# Altium schematic sheet Switches.SchDoc
size A; SheetNumber: 7
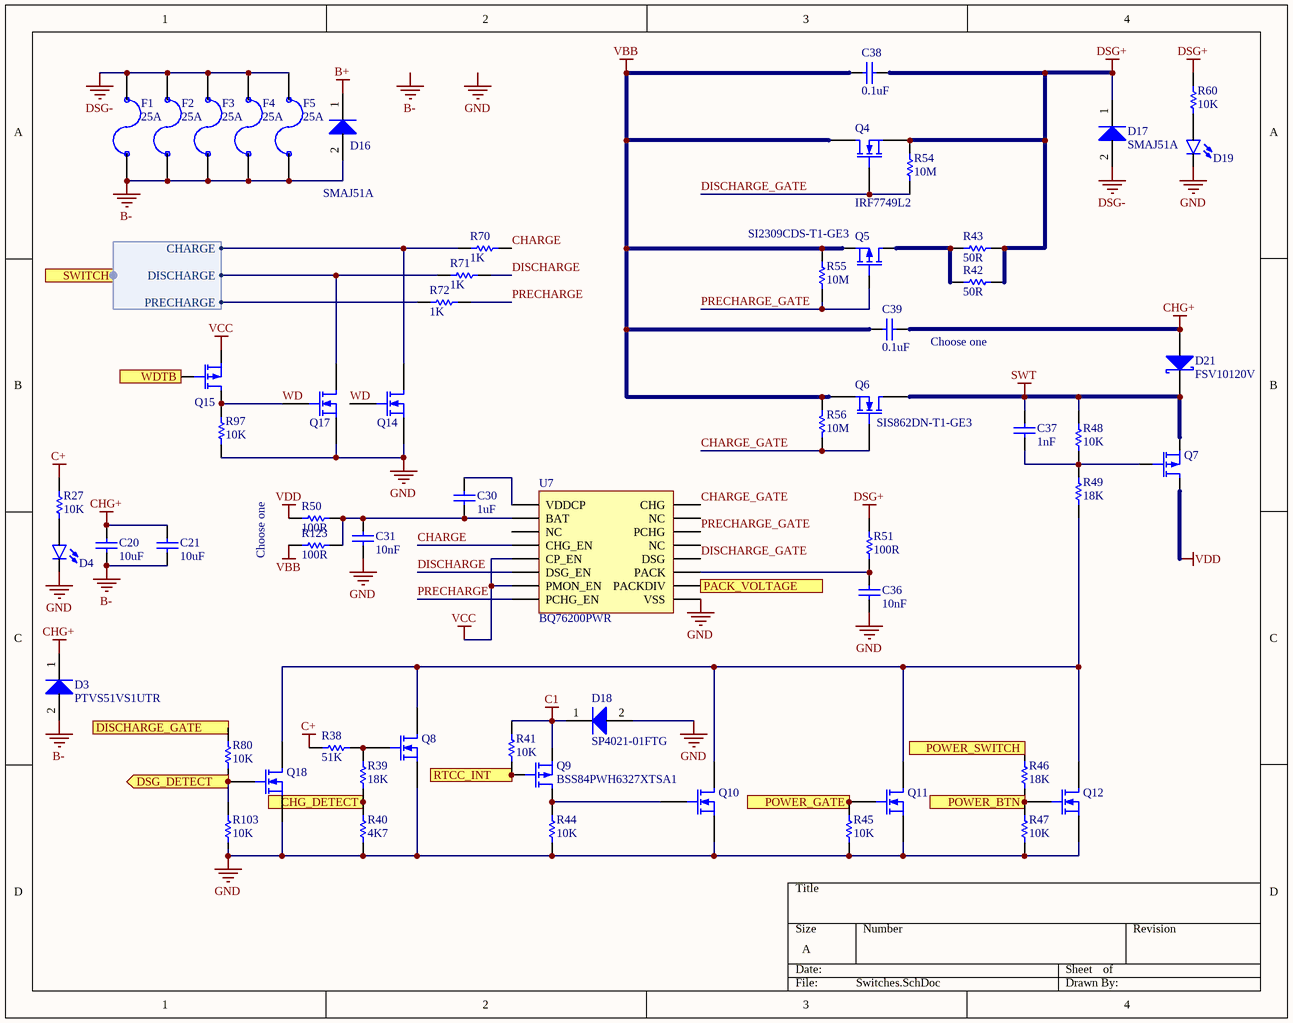
[diagram p0: Switches.SchDoc]

## Parts
C20  value 10uF  [C1206[3216X160]]  (hidden comment: 10uF 50V 1206)
C21  value 10uF  [C1206[3216X160]]  (hidden comment: 10uF 50V 1206)
C30  value 1uF  [C0603[1608X92]]  (hidden comment: 1uF 50V 0603)
C31  value 10nF  [C0603[1608X92]]  (hidden comment: 10nF 100V 0603)
C36  value 10nF  [C0603[1608X92]]  (hidden comment: 10nF 100V 0603)
C37  value 1nF  [C0603[1608X92]]  (hidden comment: 1nF 50V 0603)
C38  value 0.1uF  [C0603[1608X92]]  (hidden comment: 0.1uF 100V 0603)
C39  value 0.1uF  [C0603[1608X92]]  (hidden comment: 0.1uF 100V 0603)
D3  PTVS51VS1UTR  [SOD-123W]
D4  LED_0603_GREEN_5mA  [LED0603]  (value not drawn)
D16  SMAJ51A  [DO-214AC]
D17  SMAJ51A  [DO-214AC]
D18  SP4021-01FTG  [SOD-323]
D19  LED_0603_GREEN_5mA  [LED0603]  (value not drawn)
D21  FSV10120V  [TO-277]
F1  Current: 25A  [1206_FUSE]  (hidden comment: FUSE 1206)
F2  Current: 25A  [1206_FUSE]  (hidden comment: FUSE 1206)
F3  Current: 25A  [1206_FUSE]  (hidden comment: FUSE 1206)
F4  Current: 25A  [1206_FUSE]  (hidden comment: FUSE 1206)
F5  Current: 25A  [1206_FUSE]  (hidden comment: FUSE 1206)
Q4  IRF7749L2  [DIRECTFET-9]
Q5  SI2309CDS-T1-GE3  [SOT23-3]
Q6  SIS862DN-T1-GE3  [PowerPak-1212-8]
Q7  SQ7415AEN-T1-GE3  [PowerPak-1212-8]  (value not drawn)
Q8  BSS123WQ-7-F  [SOT323-3]  (value not drawn)
Q9  BSS84PWH6327XTSA1  [SOT323-3]
Q10  BSS123WQ-7-F  [SOT323-3]  (value not drawn)
Q11  BSS123WQ-7-F  [SOT323-3]  (value not drawn)
Q12  BSS123WQ-7-F  [SOT323-3]  (value not drawn)
Q14  BSS123WQ-7-F  [SOT323-3]  (value not drawn)
Q15  BSS84PWH6327XTSA1  [SOT323-3]  (value not drawn)
Q17  BSS123WQ-7-F  [SOT323-3]  (value not drawn)
Q18  BSS123WQ-7-F  [SOT323-3]  (value not drawn)
R27  value 10K  [R0603[1608]]  (hidden comment: 10K 1% 0603)
R38  value 51K  [R0603[1608]]  (hidden comment: 51K 1% 0603)
R39  value 18K  [R0603[1608]]  (hidden comment: 18K 1% 0603)
R40  value 4K7  [R0603[1608]]  (hidden comment: 4K7 1% 0603)
R41  value 10K  [R0603[1608]]  (hidden comment: 10K 1% 0603)
R42  value 50R  [R1206[3216]]  (hidden comment: 50R 2% 1206)
R43  value 50R  [R1206[3216]]  (hidden comment: 50R 2% 1206)
R44  value 10K  [R0603[1608]]  (hidden comment: 10K 1% 0603)
R45  value 10K  [R0603[1608]]  (hidden comment: 10K 1% 0603)
R46  value 18K  [R0603[1608]]  (hidden comment: 18K 1% 0603)
R47  value 10K  [R0603[1608]]  (hidden comment: 10K 1% 0603)
R48  value 10K  [R0603[1608]]  (hidden comment: 10K 1% 0603)
R49  value 18K  [R0603[1608]]  (hidden comment: 18K 1% 0603)
R50  value 100R  [R0603[1608]]  (hidden comment: 100R 1% 0603)
R51  value 100R  [R0603[1608]]  (hidden comment: 100R 1% 0603)
R54  value 10M  [R0603[1608]]  (hidden comment: 10M 1% 0603)
R55  value 10M  [R0603[1608]]  (hidden comment: 10M 1% 0603)
R56  value 10M  [R0603[1608]]  (hidden comment: 10M 1% 0603)
R60  value 10K  [R0603[1608]]  (hidden comment: 10K 1% 0603)
R70  value 1K  [R0603[1608]]  (hidden comment: 1K 1% 0603)
R71  value 1K  [R0603[1608]]  (hidden comment: 1K 1% 0603)
R72  value 1K  [R0603[1608]]  (hidden comment: 1K 1% 0603)
R80  value 10K  [R0603[1608]]  (hidden comment: 10K 1% 0603)
R97  value 10K  [R0603[1608]]  (hidden comment: 10K 1% 0603)
R103  value 10K  [R0603[1608]]  (hidden comment: 10K 1% 0603)
R123  value 100R  [R0603[1608]]  (hidden comment: 100R 1% 0603)
U7  BQ76200PWR  [TSSOP-16]

## Ports
CHG_DETECT (out), DISCHARGE_GATE (in), DSG_DETECT (out), PACK_VOLTAGE (out), POWER_BTN (out), POWER_GATE (in), POWER_SWITCH (in), RTCC_INT (in), SWITCH (harness Switches), WDTB (in)

## Harnesses
Switches: CHARGE, DISCHARGE, PRECHARGE

## Nets
B+: D16.1(K)
B-: C20.1 C21.1 D3.2(A) D16.2(A) F1.2 F2.2 F3.2 F4.2 F5.2
C1: D18.1(K) Q9.2(S) R41.1
C+: R27.2 R38.2
CHG+: C20.2 C21.2 C39.2 D3.1(K) D21.2(A)
DSG+: C38.2 D17.1(K) Q4.2(S) R42.2 R43.2 R51.2 R54.2 R60.2
DSG-: D17.2(A) F1.1 F2.1 F3.1 F4.1 F5.1
GND: C31.1 C36.1 D4.C D18.2(A) D19.C Q8.2(S) Q10.2(S) Q11.2(S) Q12.2(S) Q14.2(S) Q17.2(S) Q18.2(S) R40.1 R44.1 R45.1 R47.1 R97.1 R103.1 U7.9(VSS)
SWT: C37.2 D21.1(K) Q6.3(D) Q7.1(S) R48.2
VBB: C38.1 C39.1 Q4.3(D) Q5.3(S) Q6.1(S) R55.2 R56.2 R123.1
VCC: Q15.2(S) U7.5(CP_EN) U7.7(PMON_EN)
VDD: Q7.3(D) R50.1
CHARGE: R70.1 U7.4(CHG_EN)
CHARGE_GATE: Q6.2(G) R56.1 U7.16(CHG)
CHG_DETECT: R39.1 R40.2 ; port CHG_DETECT
DISCHARGE: R71.1 U7.6(DSG_EN)
DISCHARGE_GATE: Q4.1(G) R54.1 U7.12(DSG)
DISCHARGE_GATE: R80.2 ; port DISCHARGE_GATE  [a separate net that carries the same name]
DSG_DETECT: Q18.1(G) R80.1 R103.2 ; port DSG_DETECT
PACK_VOLTAGE: U7.10(PACKDIV) ; port PACK_VOLTAGE
POWER_BTN: Q12.1(G) R46.1 R47.2 ; port POWER_BTN
POWER_GATE: Q11.1(G) R45.2 ; port POWER_GATE
POWER_SWITCH: R46.2 ; port POWER_SWITCH
PRECHARGE: R72.1 U7.8(PCHG_EN)
PRECHARGE_GATE: Q5.1(G) R55.1 U7.14(PCHG)
RTCC_INT: Q9.1(G) R41.2 ; port RTCC_INT
WD: Q14.1(G) Q15.3(D) Q17.1(G) R97.2
WDTB: Q15.1(G) ; port WDTB
NetC30_1: C30.1 C31.2 R50.2 R123.2 U7.2(BAT)
NetC30_2: C30.2 U7.1(VDDCP)
NetC36_2: C36.2 R51.1 U7.11(PACK)
NetC37_1: C37.1 Q7.2(G) R48.1 R49.2
NetD4_A: D4.A R27.1
NetD19_A: D19.A R60.1
NetQ5_2: Q5.2(D) R42.1 R43.1
NetQ8_1: Q8.1(G) R38.1 R39.2
NetQ8_3: Q8.3(D) Q10.3(D) Q11.3(D) Q12.3(D) Q18.3(D) R49.1
NetQ9_3: Q9.3(D) Q10.1(G) R44.2
NetQ14_3: Q14.3(D) R70.2 ; port SWITCH.CHARGE
NetQ17_3: Q17.3(D) R71.2 ; port SWITCH.DISCHARGE
NetR72_2: R72.2 ; port SWITCH.PRECHARGE

Not connected (* = marked no-connect by the designer): U7 3(NC) 13(NC) 15(NC)

## Notes on the sheet
- Choose one
- Labels drawn without touching a wire or pin: B-, GND

## Library data of the parts
C20 C21 = CAP_10uF_50V_1206_20%: 10uF 50V 20% 1206 (3216 Metric); PartNumber: UMK316BBJ106ML-T; Manufacturer: Taiyo Yuden; Tolerance: 20%; Mounting Technology: Surface Mount; PackageReference: 1206; PackageDescription: 1206 (3216 Metric); Voltage: 50V
C30 = CAP_1uF_50V_0603_10%: 1uF 50V 10% 0603 (1608 Metric); PartNumber: GRM188R61H105KAALD; Manufacturer: Murata; TemperatureCoefficient: X5R; Tolerance: 10%; Mounting Technology: Surface Mount; PackageReference: 0603; PackageDescription: 0603 (1608 Metric); Voltage: 50V
C31 C36 = CAP_10nF_100V_0603_10%: 10nF 100V 10% 0603 (1608 Metric); PartNumber: GRM188R72A103KA01D; Manufacturer: Murata; TemperatureCoefficient: X7R; Tolerance: 10%; Mounting Technology: Surface Mount; PackageReference: 0603; PackageDescription: 0603 (1608 Metric); Voltage: 100V
C37 = CAP_1nF_50V_0603_5%: 1nF 50V 5% 0603 (1608 Metric); PartNumber: GRM1885C1H102JA01D; Manufacturer: Murata; TemperatureCoefficient: C0G; Mounting Technology: Surface Mount; PackageReference: 0603; PackageDescription: 0603 (1608 Metric); Voltage: 50V; Tolerance: 5%
C38 C39 = CAP_0.1uF_100V_0603_10%: 0.1uF 100V 10% 0603 (1608 Metric); PartNumber: GRM188R72A104KA35D; Manufacturer: Murata; TemperatureCoefficient: X7R; Mounting Technology: Surface Mount; PackageReference: 0603; PackageDescription: 0603 (1608 Metric); Voltage: 100V; Tolerance: 10%
D3 = PTVS51VS1UTR,115: Manufacturer: NXP; Mounting Technology: Surface Mount; PartNumber: PTVS51VS1UTR,115; PackageReference: SOD-123W; PackageDescription: SOD123W, 2-Leads
D4 D19 = LED_0603_GREEN_5mA: PartNumber: LTST-C193TGKT-5A; Manufacturer: Lite-On Inc.; PackageReference: 0603; PackageDescription: 0603 (1608 Metric); Mounting Technology: Surface Mount
D16 D17 = SMAJ51A-E3/61: Manufacturer: Vishay; PartNumber: SMAJ51A-E3/61; PackageReference: DO-214AC; Mounting Technology: Surface Mount; PackageDescription: DO-214AC, 2 Leads
D18 = SP4021-01FTG: Manufacturer: Littelfuse; PartNumber: SP4021-01FTG; PackageReference: SOD-323-2; Mounting Technology: Surface Mount
D21 = FSV10120V: Schottky Diodes & Rectifiers 10 Amp 120V Schottky Rectifier; Manufacturer: Fairchild Semiconductor; PackageReference: TO-277-3; PartNumber: FSV10120V; Mounting Technology: Surface Mount
F1-F5 = FUSE 1206: Surface Mount Fuses UST 1206 FUSE 25A F; PartNumber: 3413.0332.22; Manufacturer: Schurter; Mounting Technology: Surface Mount; PackageReference: 1206; PackageDescription: 1206 (3216 Metric)
Q4 = IRF7749L2: N-Channel MOSFET; PartNumber: IRF7749L1TRPBF; Manufacturer: Infineon Technologies; PackageReference: DIRECTFET L8; PackageDescription: DirectFET™ Isometric L8; Mounting Technology: Surface Mount
Q5 = SI2309CDS-T1-GE3: P-Channel MOSFET; Manufacturer: Vishay; PackageReference: SOT23-3; Mounting Technology: Surface Mount; PartNumber: SI2309CDS-T1-GE3
Q6 = SIS862DN-T1-GE3: N-Channel MOSFET; Manufacturer: Vishay; PackageReference: PowerPAK-1212-8; PartNumber: SIS862DN-T1-GE3; Mounting Technology: Surface Mount
Q7 = SQ7415AEN-T1-GE3: P-Channel MOSFET; Manufacturer: Vishay; PartNumber: SQ7415AEN-T1-GE3; Mounting Technology: Surface Mount; PackageReference: PowerPAK-1212-8
Q8 Q10-Q12 Q14 Q17 Q18 = BSS123WQ-7-F: N-Channel MOSFET; Manufacturer: Diodes Incorporated; PackageReference: SOT-323-3; PartNumber: BSS123WQ-7-F; Mounting Technology: Surface Mount
Q9 Q15 = BSS84PW H6327: P-Channel MOSFET; Manufacturer: Infineon; Mounting Technology: Surface Mount; PartNumber: BSS84PWH6327XTSA1; PackageReference: SOT323-3
R27 R41 R44 R45 R47 R48 R60 R80 R97 R103 = RES_10K_0603_1%: 10K 0.25W 1% 0603 (1005 Metric); Manufacturer: Vishay / Dale; PartNumber: CRCW060310K0FKEAHP; Power: 0.25W; Tolerance: 1%; Mounting Technology: Surface Mount; PackageReference: 0603; PackageDescription: 0603 (1608 Metric); ComponentLink1Description: Datasheet; ComponentLink1URL: http://www.vishay.com/docs/20065/rcse3.pdf
R38 = RES_51K_0603_1%: 51K 0.25W 1% 0603 (1005 Metric); Manufacturer: Panasonic; PartNumber: ERJ-PA3F5102V; Power: 0.25W; Tolerance: 1%; Mounting Technology: Surface Mount; PackageReference: 0603; PackageDescription: 0603 (1608 Metric); ComponentLink1Description: Datasheet; ComponentLink1URL: http://www.vishay.com/docs/20043/crcwhpe3.pdf
R39 R46 R49 = RES_18K_0603_1%: 18K 0.25W 1% 0603 (1005 Metric); Manufacturer: Vishay / Dale; PartNumber: CRCW060318K0FKEAHP; Tolerance: 1%; Power: 0.25W; Mounting Technology: Surface Mount; PackageReference: 0603; PackageDescription: 0603 (1608 Metric); ComponentLink1Description: Datasheet; ComponentLink1URL: http://www.vishay.com/docs/20043/crcwhpe3.pdf
R40 = RES_4K7_0603_1%: 4K7 0.25W 1% 0603 (1005 Metric); Manufacturer: Vishay / Dale; PartNumber: CRCW06034K70FKEAHP; Tolerance: 1%; Power: 0.25W; Mounting Technology: Surface Mount; PackageReference: 0603; PackageDescription: 0603 (1608 Metric); ComponentLink1Description: Datasheet; ComponentLink1URL: http://www.vishay.com/docs/20043/crcwhpe3.pdf
R42 R43 = RES_50R_1206_2%: 50R 2.4W 2% 1206 (3216 Metric); Manufacturer: Vishay; PartNumber: RCP1206W50R0GEB; Tolerance: 2%; Power: 2.4W; Mounting Technology: Surface Mount; PackageReference: 1206; PackageDescription: 1206 (3216 Metric); ComponentLink1Description: Datasheet; ComponentLink1URL: http://www.vishay.com/docs/31098/rcp.pdf
R50 R51 R123 = RES_100R_0603_1%: 100R 0.25W 1% 0603 (1005 Metric); Manufacturer: Vishay / Dale; PartNumber: CRCW0603100RFKEAHP; Power: 0.25W; Tolerance: 1%; Mounting Technology: Surface Mount; PackageReference: 0603; PackageDescription: 0603 (1608 Metric); ComponentLink1Description: Datasheet; ComponentLink1URL: http://www.vishay.com/docs/20043/crcwhpe3.pdf
R54-R56 = RES_10M_0603_1%: 10M 0.25W 1% 0603 (1005 Metric); Manufacturer: Vishay / Dale; PartNumber: RCS060310M0FKEA; Tolerance: 1%; Power: 0.25W; Mounting Technology: Surface Mount; PackageReference: 0603; PackageDescription: 0603 (1608 Metric); ComponentLink1Description: Datasheet; ComponentLink1URL: http://www.vishay.com/docs/20043/crcwhpe3.pdf
R70-R72 = RES_1K_0603_1%: 1K 0.25W 1% 0603 (1005 Metric); Manufacturer: Vishay / Dale; PartNumber: CRCW06031K00FKEAHP; Tolerance: 1%; Power: 0.25W; Mounting Technology: Surface Mount; PackageReference: 0603; PackageDescription: 0603 (1608 Metric); ComponentLink1Description: Datasheet; ComponentLink1URL: http://www.vishay.com/docs/20043/crcwhpe3.pdf
U7 = BQ76200PWR: Battery Management Fast high side NCH drive; Manufacturer: Texas Instruments; PartNumber: BQ76200PWR; PackageReference: TSSOP-16; Mounting Technology: Surface Mount